# EAGLE design DCSolar_3Cur_1Volt (EAGLE 5.10)
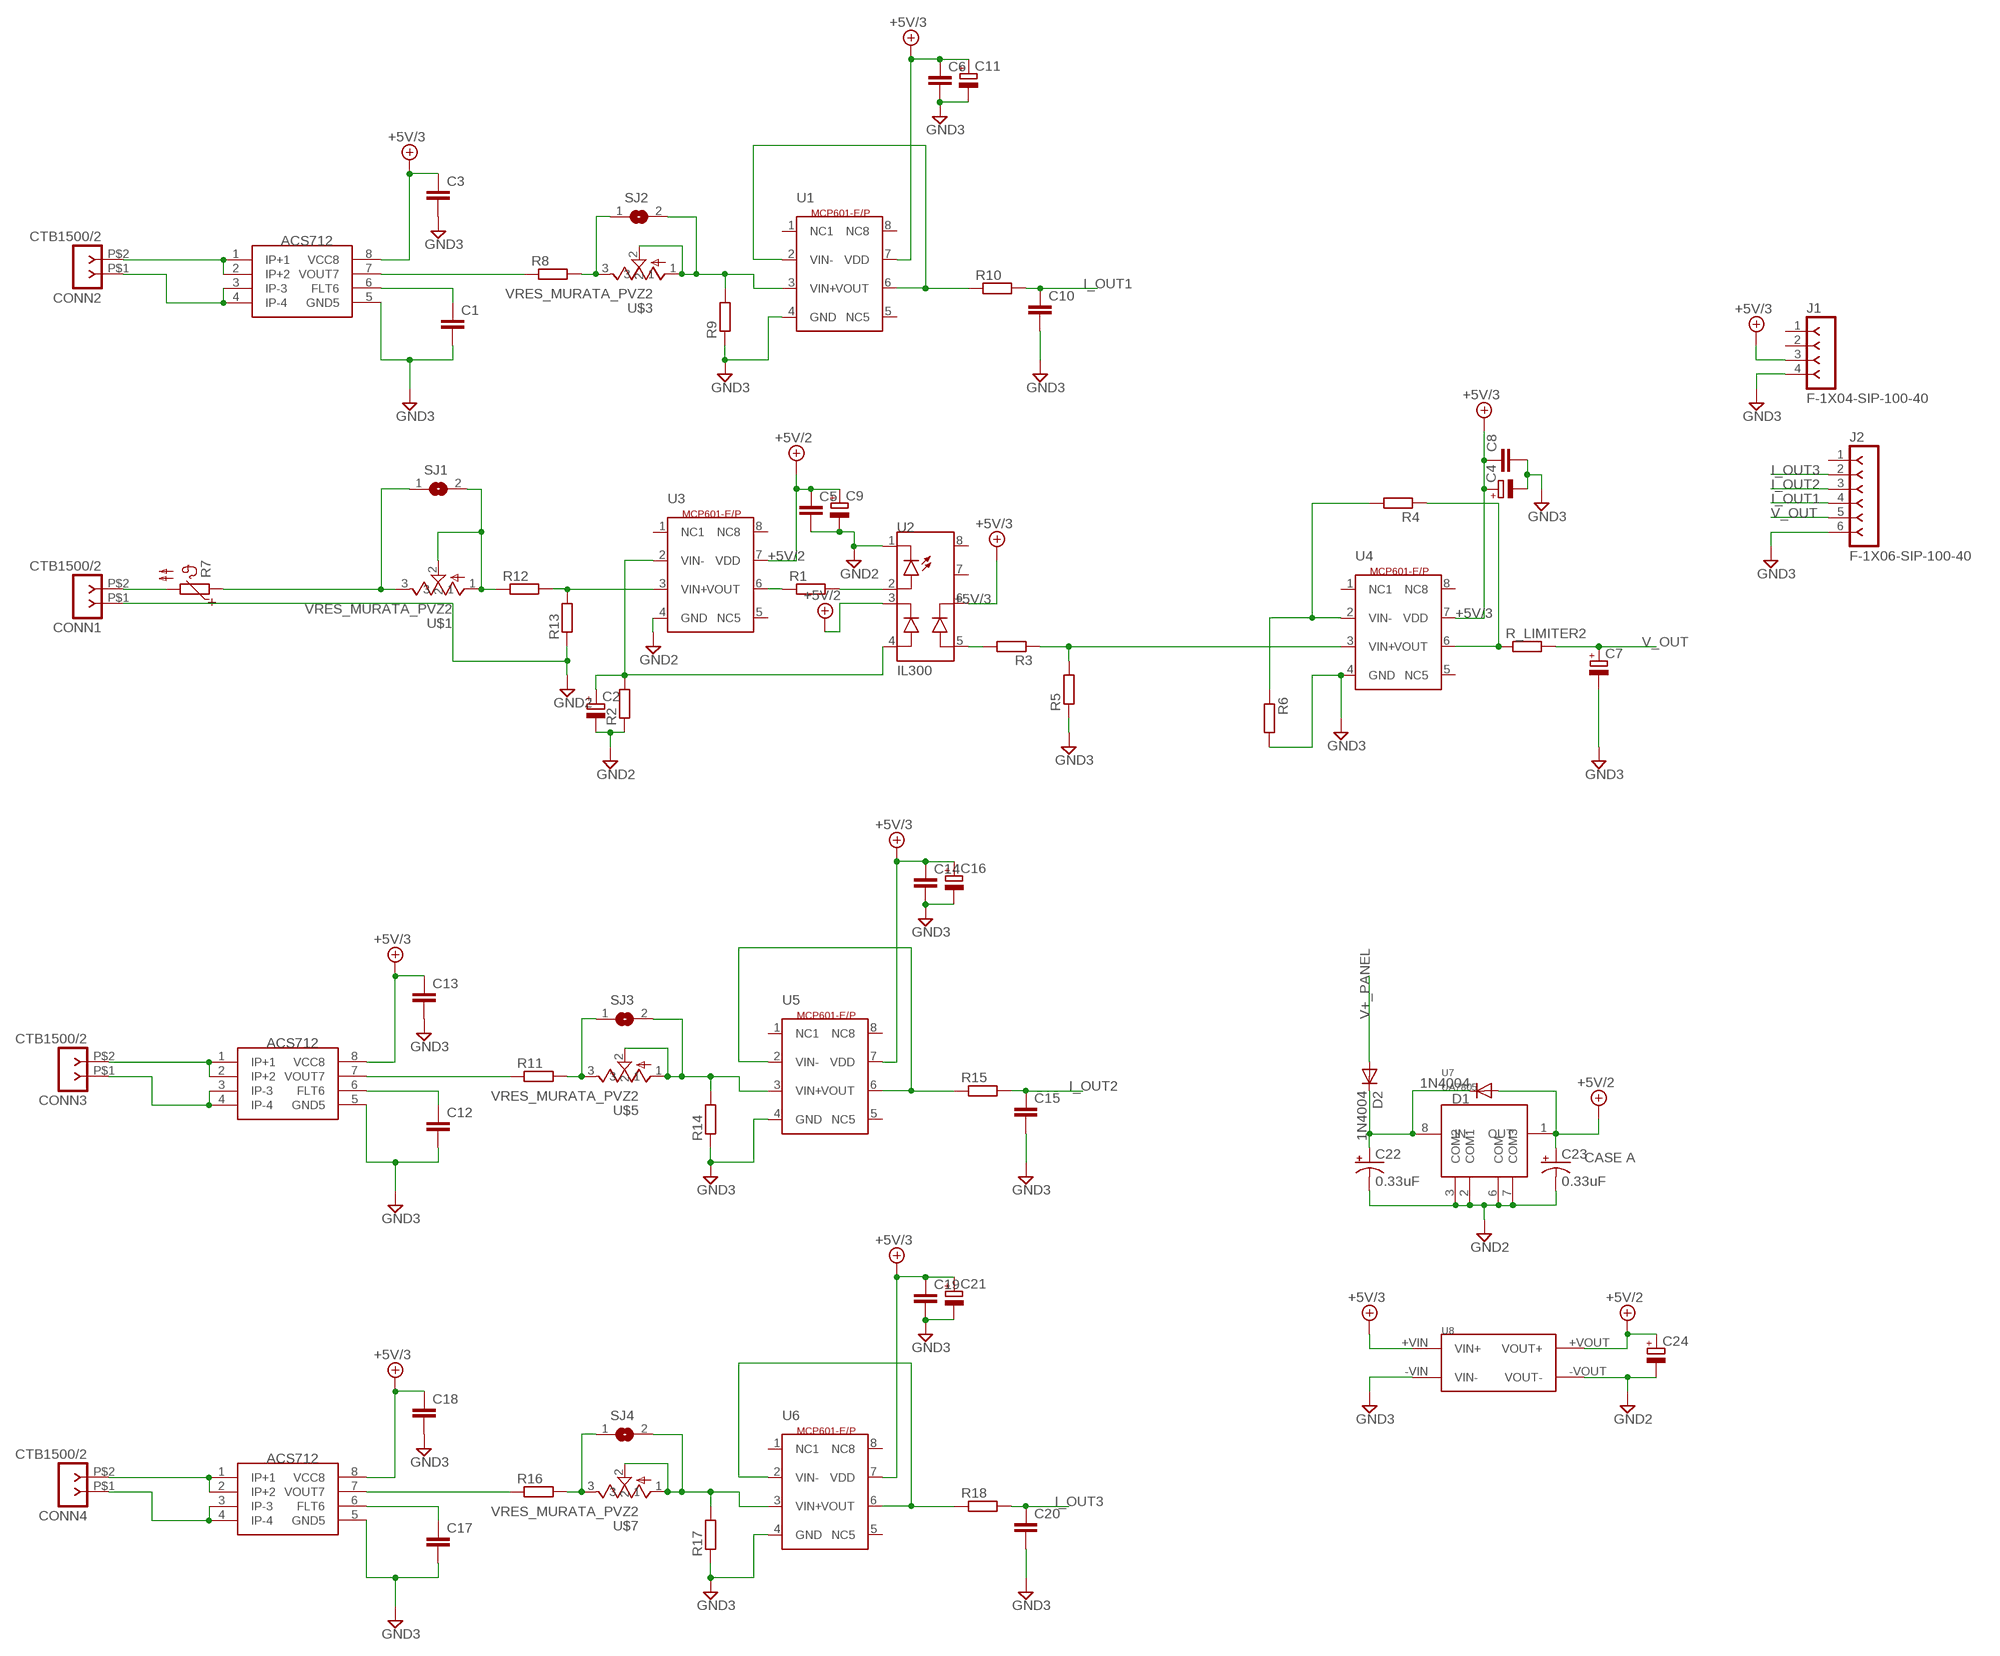
[diagram p0: schematic, sheet 1]

## Parts
C1  C-EU025-030X050  [C025-030X050]
C2  CPOL-EUE2.5-6  [E2,5-6]
C3  C-EUC0603  [C0603]
C4  CPOL-EUE2.5-6  [E2,5-6]
C5  C-EUC0603  [C0603]
C6  C-EUC0603  [C0603]
C7  CPOL-EUE2.5-6  [E2,5-6]
C8  C-EUC0603  [C0603]
C9  CPOL-EUE2.5-6  [E2,5-6]
C10  C-EU025-030X050  [C025-030X050]
C11  CPOL-EUE2.5-6  [E2,5-6]
C12  C-EU025-030X050  [C025-030X050]
C13  C-EUC0603  [C0603]
C14  C-EUC0603  [C0603]
C15  C-EU025-030X050  [C025-030X050]
C16  CPOL-EUE2.5-6  [E2,5-6]
C17  C-EU025-030X050  [C025-030X050]
C18  C-EUC0603  [C0603]
C19  C-EUC0603  [C0603]
C20  C-EU025-030X050  [C025-030X050]
C21  CPOL-EUE2.5-6  [E2,5-6]
C22  0.33uF  CPOL-USA/3216-18W  [A/3216-18W]
C23  0.33uF  CPOL-USA/3216-18W  [A/3216-18W]
C24  CPOL-EUE2.5-6  [E2,5-6]
CONN1  CTB1500/2  [CTB1500-2]
CONN2  CTB1500/2  [CTB1500-2]
CONN3  CTB1500/2  [CTB1500-2]
CONN4  CTB1500/2  [CTB1500-2]
D1  1N4004  [DO41-10]
D2  1N4004  [DO41-10]
J1  F-1X04-SIP-100-40  [SIP-100-04-40]
J2  F-1X06-SIP-100-40  [SIP-100-06-40]
R1  R-EU_0207/10  [0207/10]
R2  R-EU_0207/10  [0207/10]
R3  R-EU_0207/10  [0207/10]
R4  R-EU_0207/10  [0207/10]
R5  R-EU_0207/10  [0207/10]
R6  R-EU_0207/10  [0207/10]
R7  PTC660A  [P660A]
R8  R-EU_0207/10  [0207/10]
R9  R-EU_0207/10  [0207/10]
R10  R-EU_0207/10  [0207/10]
R11  R-EU_0207/10  [0207/10]
R12  R-EU_0207/10  [0207/10]
R13  R-EU_0207/10  [0207/10]
R14  R-EU_0207/10  [0207/10]
R15  R-EU_0207/10  [0207/10]
R16  R-EU_0207/10  [0207/10]
R17  R-EU_0207/10  [0207/10]
R18  R-EU_0207/10  [0207/10]
R_LIMITER2  R-EU_0207/10  [0207/10]
SJ1  SJ  [SJ]
SJ2  SJ  [SJ]
SJ3  SJ  [SJ]
SJ4  SJ  [SJ]
U1  MCP601  [SO8]
U2  IL300  [SO8]
U3  MCP601  [SO8]
U4  MCP601  [SO8]
U5  MCP601  [SO8]
U6  MCP601  [SO8]
U7  UA7805  [R_PDSO_G8]
U8  XP_IE_1W_DCDC  [SF_IE_SIP]
U$1  VRES_MURATA_PVZ2  [MURATA_PVZ2A]
U$2  ACS712  [SO8]
U$3  VRES_MURATA_PVZ2  [MURATA_PVZ2A]
U$4  ACS712  [SO8]
U$5  VRES_MURATA_PVZ2  [MURATA_PVZ2A]
U$6  ACS712  [SO8]
U$7  VRES_MURATA_PVZ2  [MURATA_PVZ2A]

## Nets
+5V/2: C5.1 C9.+ C23.+ C24.+ D1.A U2.3(C_FB) U3.7(VDD) U7.1(OUT) U8.+VOUT(VOUT+)
+5V/3: C3.1 C4.+ C6.1 C8.1 C11.+ C13.1 C14.1 C16.+ C18.1 C19.1 C21.+ J1.3 U1.7(VDD) U2.6(C_OUT) U4.7(VDD) U5.7(VDD) U6.7(VDD) U8.+VIN(VIN+) U$2.8(VCC8) U$4.8(VCC8) U$6.8(VCC8)
GND2: C2.- C5.2 C9.- C22.- C23.- C24.- CONN1.P$1 R2.1 R13.1 U2.1(C_LED) U3.4(GND) U7.2(COM1) U7.3(COM2) U7.6(COM) U7.7(COM3) U8.-VOUT(VOUT-)
GND3: C1.2 C3.2 C4.- C6.2 C7.- C8.2 C10.2 C11.- C12.2 C13.2 C14.2 C15.2 C16.- C17.2 C18.2 C19.2 C20.2 C21.- J1.4 J2.6 R5.1 R6.2 R9.1 R14.1 R17.1 U1.4(GND) U4.4(GND) U5.4(GND) U6.4(GND) U8.-VIN(VIN-) U$2.5(GND5) U$4.5(GND5) U$6.5(GND5)
I_OUT1: C10.1 J2.4 R10.2
I_OUT2: C15.1 J2.3 R15.2
I_OUT3: C20.1 J2.2 R18.2
N$1: R1.2 U2.2(A_LED)
N$2: R1.1 U3.6(VOUT)
N$3: C2.+ R2.2 U2.4(A_FB) U3.2(VIN-)
N$4: R8.2 SJ2.1 U$3.3
N$5: CONN1.P$2 R7.2
N$6: R4.1 R_LIMITER2.1 U4.6(VOUT)
N$7: R3.2 U2.5(A_OUT)
N$8: R4.2 R6.1 U4.2(VIN-)
N$9: CONN2.P$2 U$2.1(IP+1) U$2.2(IP+2)
N$10: CONN2.P$1 U$2.3(IP-3) U$2.4(IP-4)
N$11: R10.1 U1.2(VIN-) U1.6(VOUT)
N$12: R12.2 R13.2 U3.3(VIN+)
N$13: C1.1 U$2.6(FLT6)
N$14: CONN3.P$2 U$4.1(IP+1) U$4.2(IP+2)
N$15: CONN3.P$1 U$4.3(IP-3) U$4.4(IP-4)
N$16: R8.1 U$2.7(VOUT7)
N$17: R9.2 SJ2.2 U1.3(VIN+) U$3.1 U$3.2
N$18: R12.1 SJ1.2 U$1.1 U$1.2
N$19: CONN4.P$2 U$6.1(IP+1) U$6.2(IP+2)
N$20: C12.1 U$4.6(FLT6)
N$21: R11.1 U$4.7(VOUT7)
N$22: R14.2 SJ3.2 U5.3(VIN+) U$5.1 U$5.2
N$23: R11.2 SJ3.1 U$5.3
N$24: R15.1 U5.2(VIN-) U5.6(VOUT)
N$25: CONN4.P$1 U$6.3(IP-3) U$6.4(IP-4)
N$26: C17.1 U$6.6(FLT6)
N$27: R16.1 U$6.7(VOUT7)
N$28: R17.2 SJ4.2 U6.3(VIN+) U$7.1 U$7.2
N$29: R16.2 SJ4.1 U$7.3
N$30: R18.1 U6.2(VIN-) U6.6(VOUT)
N$31: C22.+ D1.C D2.C U7.8(IN)
U4: R3.1 R5.2 U4.3(VIN+)
V+_PANEL: D2.A R7.1 SJ1.1 U$1.3
V_OUT: C7.+ J2.5 R_LIMITER2.2
Unconnected: J1.1 J1.2 J2.1 U1.1(NC1) U1.5(NC5) U1.8(NC8) U2.7(PIN7) U2.8(PIN8) U3.1(NC1) U3.5(NC5) U3.8(NC8) U4.1(NC1) U4.5(NC5) U4.8(NC8) U5.1(NC1) U5.5(NC5) U5.8(NC8) U6.1(NC1) U6.5(NC5) U6.8(NC8)

## Notes on the sheet
- CASE A

## Library data of the parts
C1 C3 C5 C6 C8 C10 C12-C15 C17-C20 = resistor:C-EU: CAPACITOR, European symbol
C2 C4 C7 C9 C11 C16 C21 C24 = resistor:CPOL-EU: POLARIZED CAPACITOR, European symbol
C22 C23 = resistor:CPOL-US: POLARIZED CAPACITOR, American symbol
CONN1-CONN4 = eko-parts:CTB1500/2
D1 D2 = diode:1N4004: DIODE general purpose rectifier, 1 A
J1 = con-headers-jp:F-1X04-: FEMALE HEADER
J2 = con-headers-jp:F-1X06-: FEMALE HEADER
R1-R6 R8-R18 R_LIMITER2 = resistor:R-EU_: RESISTOR, European symbol
R7 = ptc-ntc:PTC660A: PHILIPS PTC; OC_FARNELL: unknown; OC_NEWARK: unknown
SJ1-SJ4 = jumper:SJ: SMD solder JUMPER
U1 U3-U6 = eko-parts:MCP601
U2 = eko-parts:IL300
U7 = eko-parts:UA7805
U8 = eko-parts:XP_IE_1W_DCDC
U$1 U$3 U$5 U$7 = eko-parts:VRES_MURATA_PVZ2: http://www.farnell.com/datasheets/477473.pdf http://onecall.farnell.com/jsp/search/browse.jsp?N=411+202462+110264549+732+502&Ns=P_PRICE_ONECALL_UK|0&locale=en_GB&appliedparametrics=true&getResults=true&suppressRedirect=true&originalQueryURL=/jsp/search/browse.jsp%3FN%3D411%2B202462%26No%3D0%26getResults%3Dtrue%26appliedparametrics%3Dtrue%26locale%3Den_GB%26divisionLocale%3Den_GB%26catalogId%3D%26prevNValues%3D411%2B202462
U$2 U$4 U$6 = eko-parts:ACS712

## Board
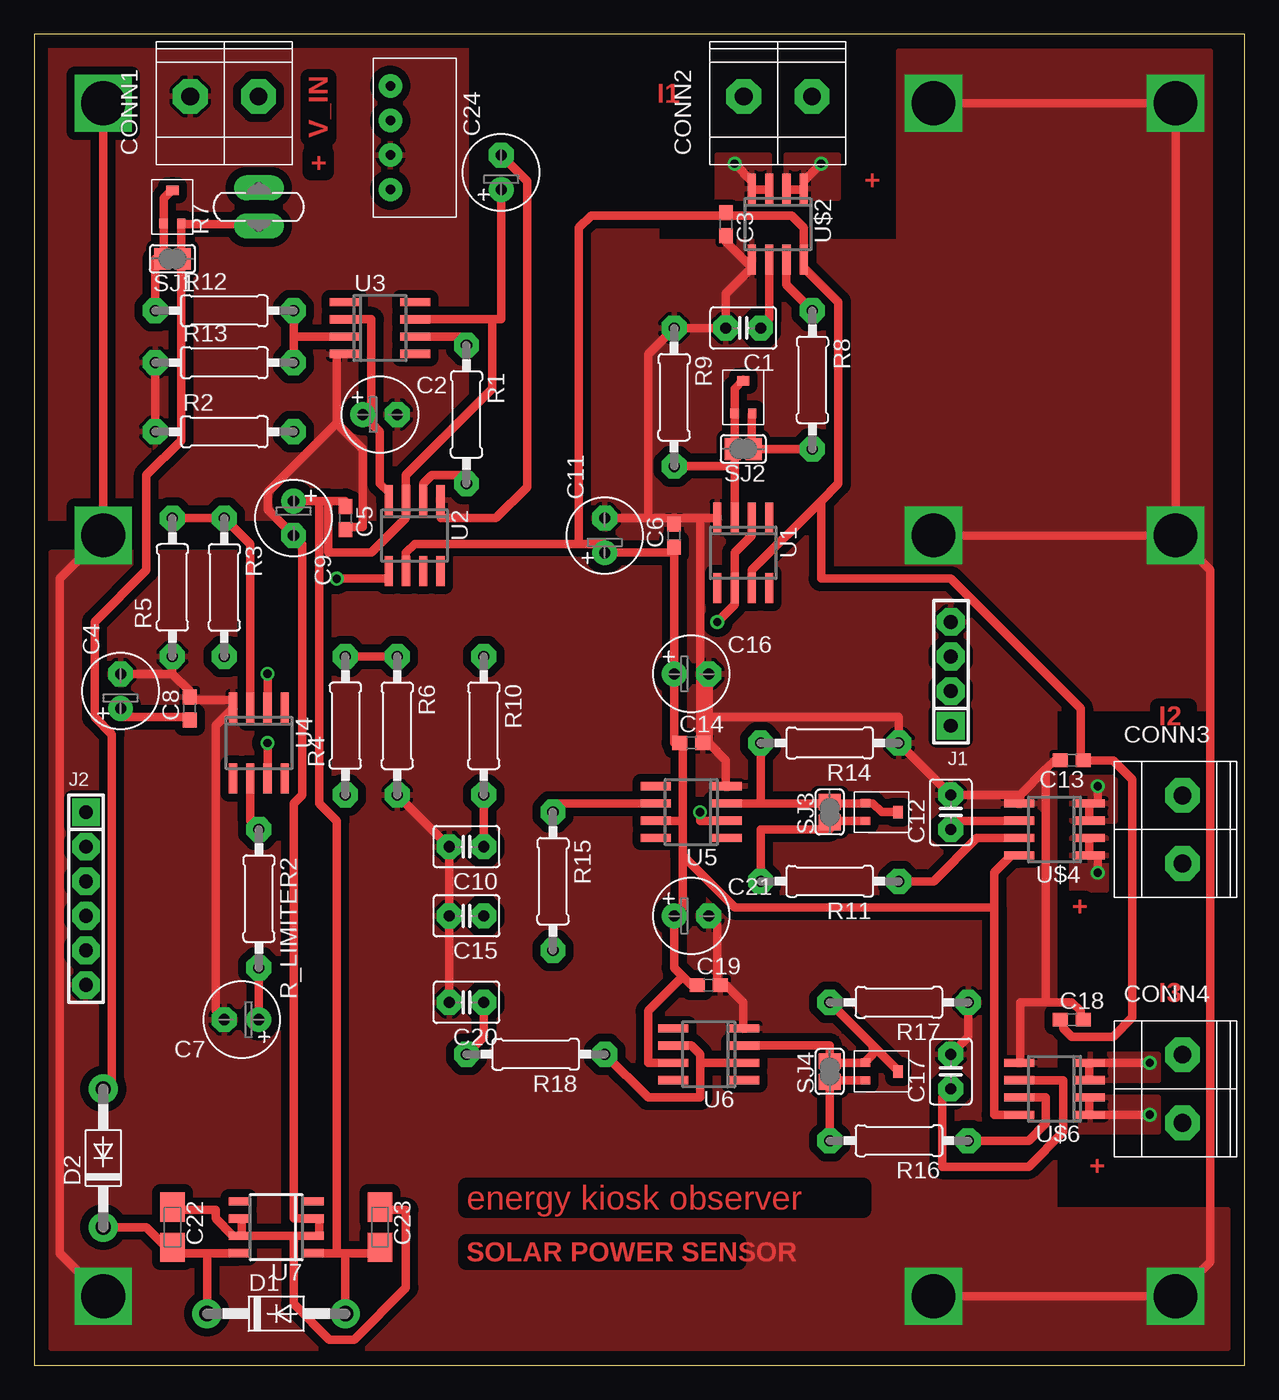
[diagram p1: board, top side]
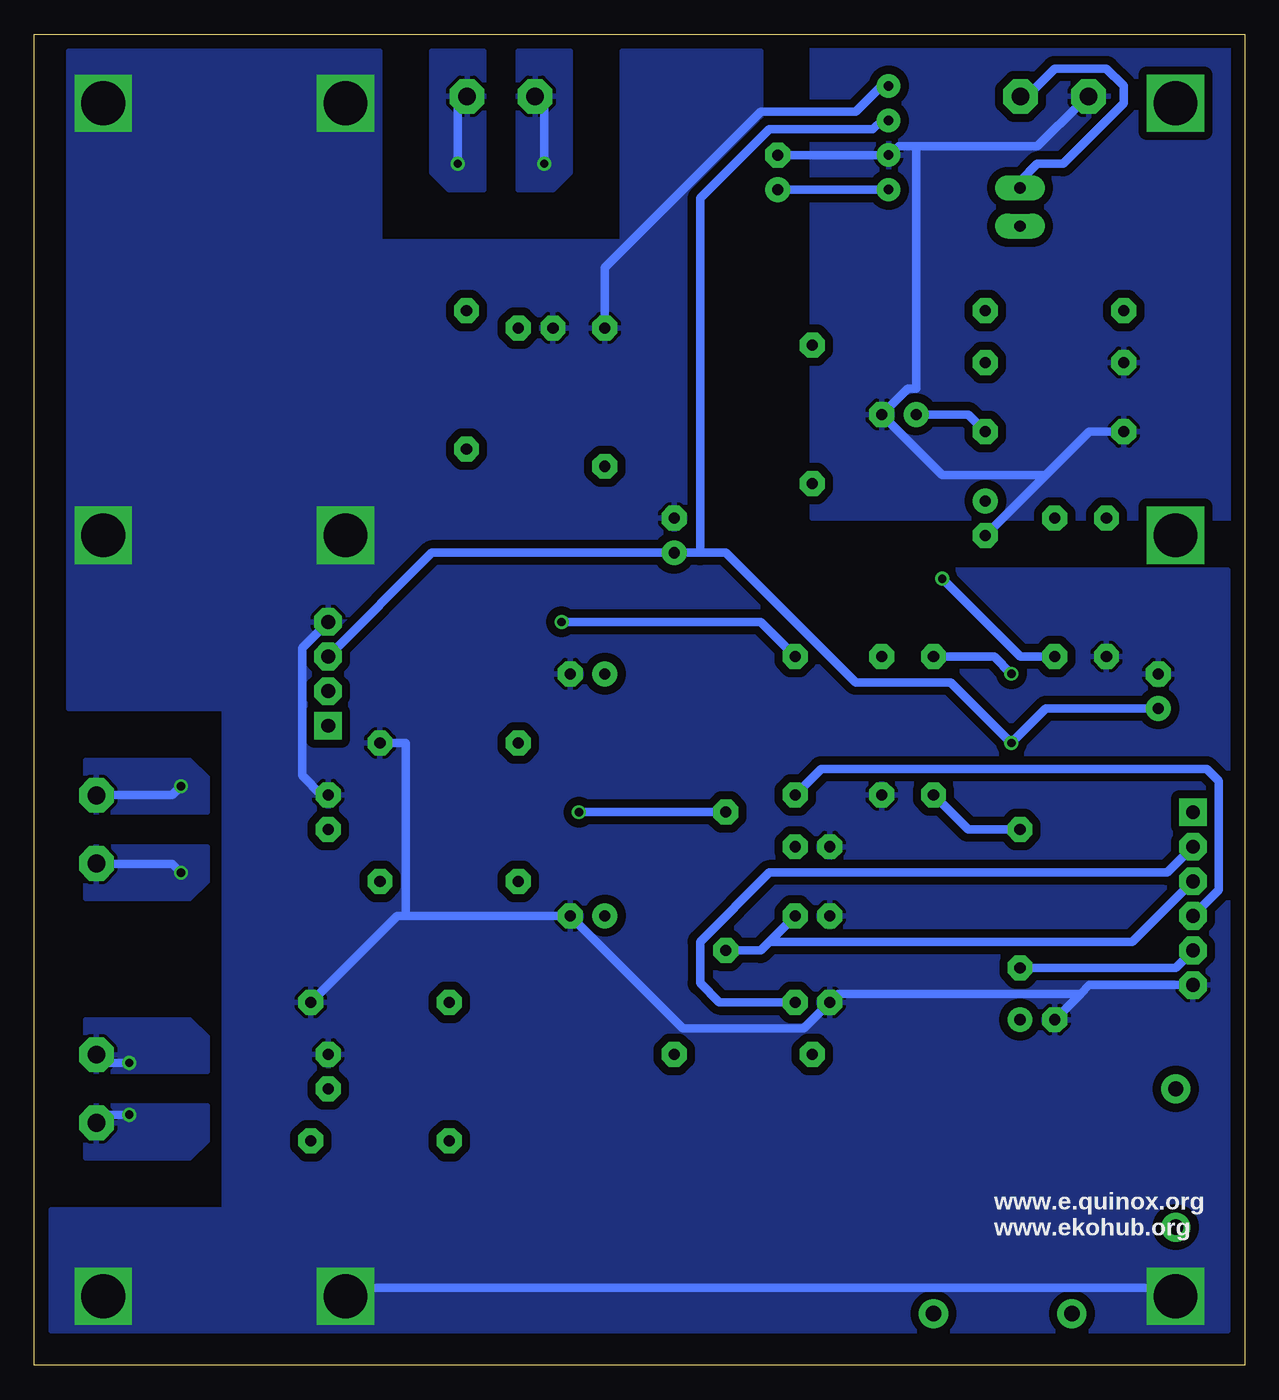
[diagram p2: board, bottom side, seen from below]

Size 88.9 x 97.79 mm. Coordinates in mm from the lower left corner, seen from the top.
Outline: 0,0 88.9,0 88.9,97.79 0,97.79 0,0
Copper layers (1*16): Top 0.035mm / dielectric 1.5mm / Bottom 0.035mm
Design rules "default *": minimum track width 15mil, minimum drill 24mil, track to track 16mil, track to pad 16mil, pad to pad 16mil, via to via 16mil, smd to smd 8mil, copper to edge 40mil, drill to drill 8mil, minimum pad ring 20mil, minimum via ring 8mil, stop-mask expansion 4mil, vias tented up to drill 0mil, thermal gap 10mil

### Footprints (pad centres in the part's own frame; a part is rotated, then mirrored left to right if it is on the bottom)
C025-030X050 = drill 0.813 octagon: 1 -1.27,0; 2 1.27,0
E2,5-6 = drill 0.813 pad 1.6 round: + -1.27,0 | drill 0.813 pad 1.6 octagon: - 1.27,0
C0603 = smd 1.1 x 1: 1 -0.85,0; 2 0.85,0
A/3216-18W = smd 2.15 x 1.8: + 1.475,0; - -1.475,0
CTB1500-2 = drill 1.3 pad 2.54 octagon: P$1 -2.5,0.5; P$2 2.5,0.5
DO41-10 = drill 1.118 round: A 5.08,0; C -5.08,0
SIP-100-04-40 = drill 1.016 pad 1.778 square: 1 -3.81,0 | drill 1.016 pad 1.778 octagon: 2 -1.27,0; 3 1.27,0; 4 3.81,0
SIP-100-06-40 = drill 1.016 pad 1.778 square: 1 -6.35,0 | drill 1.016 pad 1.778 octagon: 2 -3.81,0; 3 -1.27,0; 4 1.27,0; 5 3.81,0; 6 6.35,0
0207/10 = drill 0.813 octagon: 1 -5.08,0; 2 5.08,0
P660A = drill 0.813 long: 1 -1.397,0; 2 1.397,0
SJ = smd 1.168 x 1.6: 1 -0.762,0; 2 0.762,0
SO8 = smd 0.6 x 2.2: 1 -1.905,-2.6; 2 -0.635,-2.6; 3 0.635,-2.6; 4 1.905,-2.6; 5 1.905,2.6; 6 0.635,2.6; 7 -0.635,2.6; 8 -1.905,2.6
R_PDSO_G8 = smd 0.6 x 1.5: 1 -1.905,-2.75; 2 -0.635,-2.75; 3 0.635,-2.75; 4 1.905,-2.75; 5 1.905,2.75; 6 0.635,2.75; 7 -0.635,2.75; 8 -1.905,2.75
SF_IE_SIP = drill 0.7 round: +VIN -1.27,-1.778; +VOUT 3.81,-1.778; -VIN -3.81,-1.778; -VOUT 1.27,-1.778
MURATA_PVZ2A = smd 0.6 x 0.7: 1 -0.65,-1.2; 3 0.65,-1.2 | smd 0.9 x 0.7: 2 0,1.2

### Placement (x,y rotation side)
C1  52.07,76.2 180 top
C2  25.4,69.85 0 top
C3  50.8,83.82 270 top
C4  6.35,49.53 90 top
C5  22.86,62.23 270 top
C6  46.99,60.96 90 top
C7  15.24,25.4 180 top
C8  11.43,48.26 90 top
C9  19.05,62.23 270 top
C10  31.75,38.1 180 top
C11  41.91,60.96 90 top
C12  67.31,40.64 90 top
C13  76.2,44.45 180 top
C14  48.26,45.72 0 top
C15  31.75,33.02 180 top
C16  48.26,50.8 0 top
C17  67.31,21.59 90 top
C18  76.2,25.4 0 top
C19  49.53,27.94 0 top
C20  31.75,26.67 180 top
C21  48.26,33.02 0 top
C22  10.16,10.16 270 top
C23  25.4,10.16 270 top
C24  34.29,87.63 90 top
CONN1  13.97,92.71 0 top
CONN2  54.61,92.71 0 top
CONN3  83.82,39.37 270 top
CONN4  83.82,20.32 270 top
D1  17.78,3.81 0 top
D2  5.08,15.24 90 top
J1  67.31,50.8 90 top
J2  3.81,34.29 270 top
R1  31.75,69.85 270 top
R2  13.97,68.58 0 top
R3  13.97,57.15 270 top
R4  22.86,46.99 90 top
R5  10.16,57.15 90 top
R6  26.67,46.99 270 top
R7  16.51,85.09 90 top
R8  57.15,72.39 270 top
R9  46.99,71.12 270 top
R10  33.02,46.99 270 top
R11  58.42,35.56 180 top
R12  13.97,77.47 0 top
R13  13.97,73.66 0 top
R14  58.42,45.72 180 top
R15  38.1,35.56 270 top
R16  63.5,16.51 180 top
R17  63.5,26.67 180 top
R18  36.83,22.86 180 top
R_LIMITER2  16.51,34.29 270 top
SJ1  10.16,81.28 180 top
SJ2  52.07,67.31 180 top
SJ3  58.42,40.64 90 top
SJ4  58.42,21.59 90 top
U1  52.07,59.69 180 top
U2  27.94,60.96 180 top
U3  25.4,76.2 270 top
U4  16.51,45.72 180 top
U5  48.26,40.64 90 top
U6  49.53,22.86 90 top
U7  17.78,10.16 90 top
U8  27.94,90.17 270 top
U$1  10.16,85.09 0 top
U$2  54.61,83.82 180 top
U$3  52.07,71.12 0 top
U$4  74.93,39.37 90 top
U$5  62.23,40.64 270 top
U$6  74.93,20.32 90 top
U$7  62.23,21.59 270 top

### Tracks (layer width: path | path; a pad name or v marks a point on that pad's centre or on a via)
+5V/2
  Top 0.61: 33.66,76.83 34.29,76.83 C24.+ | 33.66,76.83 U3.7 | 22.86,8.26 25.4,8.26 C23.+ | 22.86,8.26 22.23,8.26 | 22.23,8.26 U7.1 | D1.A 22.86,8.26 | 20.95,63.5 C9.+ | 20.95,63.5 21.59,63.5 | 21.59,63.5 22.86,63.5 C5.1 | 21.59,63.5 21.59,59.69 24.77,59.69 27.3,62.23 U2.3 27.3,65.41 33.66,71.75 33.66,76.83 | 22.23,8.26 22.23,40.01 20.95,41.27 20.95,63.5
  Bottom 0.61: C24.+ U8.+VOUT
+5V/3  (via drill 0.61)
  Top 0.61: C18.1 75.56,25.4 75.56,24.77 76.2,24.13 79.22,24.13 80.64,25.55 80.64,43.03 79.22,44.45 C13.1 76.83,44.45 76.83,48.26 67.31,57.78 57.78,57.78 57.78,63.5 | 50.8,84.45 55.62,84.45 56.52,83.56 U$2.8 56.52,80.64 59.05,78.11 59.05,64.77 57.78,63.5 | 57.78,63.5 52.7,58.42 U1.7 | 70.48,33.66 70.48,36.2 71.75,37.47 U$4.8 | 70.48,33.66 70.48,18.41 U$6.8 | 47.62,28.57 46.99,29.21 C21.+ 47.62,33.66 47.62,37.47 | 47.62,28.57 48.26,27.94 C19.1 | 47.62,28.57 45.09,26.04 45.09,22.23 U6.7 | 47.62,40.01 47.62,45.72 C14.1 46.99,45.72 C16.+ 46.99,59.69 | 47.62,40.01 U5.7 | 47.62,40.01 47.62,37.47 | 70.48,33.66 51.44,33.66 47.62,37.47 | C4.+ 6.35,47.62 11.43,47.62 C8.1 | v17.14,45.72 U4.7 | 46.99,59.69 C11.+ 41.91,60.33 40.01,60.33 | 40.01,60.33 27.94,60.33 27.3,59.69 U2.6 | 46.99,59.69 C6.1 | 40.01,60.33 40.01,83.56 40.9,84.45 50.8,84.45 | 50.8,84.45 C3.1
  Bottom 0.61: C4.+ 14.61,48.26 v17.14,45.72 21.59,50.16 28.57,50.16 38.1,59.69 40.01,59.69 | 40.01,59.69 40.01,85.72 34.92,90.81 27.3,90.81 26.67,91.44 U8.+VIN | 40.01,59.69 C11.+ 59.69,59.69 J1.3
GND2
  Top 0.61: C24.- 36.2,87 36.2,64.52 33.91,62.23 29.84,62.23 U2.1 | 15.24,9.53 15.24,10.79 U7.6 | 15.24,9.53 19.05,9.53 | 15.24,9.53 U7.7 14.61,9.53 13.34,10.79 13.34,11.43 10.16,11.43 C22.- | 19.05,9.53 U7.2 20.95,9.53 20.95,10.79 U7.3 19.05,10.79 19.05,41.27 19.68,41.91 19.68,60.33 C9.- 17.14,62.87 17.14,64.14 22.23,69.22 | 19.05,9.53 19.05,4.52 21.67,1.91 23.5,1.91 27.3,5.71 27.3,11.43 25.4,11.43 C23.- | 22.23,69.22 24.13,67.31 24.13,61.59 22.86,61.59 C5.2 | 22.23,69.22 22.23,74.3 U3.4 | R2.1 R13.1
  Bottom 0.61: C24.- U8.-VOUT 26.04,88.9 25.4,89.53 24.13,89.53 | 24.13,89.53 15.24,89.53 12.06,92.71 CONN1.P$1 | 14.61,65.41 11.43,68.58 R2.1 | C9.- 14.61,65.41 | 14.61,65.41 22.23,65.41 C2.- 24.77,71.75 24.13,71.75 24.13,89.53
  pour Bottom (isolate 0.61): 0,97.79 31.75,97.79 31.75,62.23 0,62.23
  pour Top (isolate 0.61): 0,97.79 31.75,97.79 31.75,62.23 0,62.23
GND3  (via drill 3.2 pad 0.41)
  Top 0.61: C20.2 C15.2 C10.2 R6.2 | 10.16,50.8 11.43,49.53 C8.2 11.43,48.9 14.61,48.9 U4.4 14.61,48.26 13.34,46.99 13.34,26.04 C7.- | 10.16,50.8 R5.1 | 10.16,50.8 C4.- | 52.7,80.64 50.8,82.55 C3.2 | 52.7,80.64 50.8,78.74 C1.2 R9.1 45.09,74.3 45.09,62.23 | 52.7,80.64 U$2.5 | C17.2 68.58,24.13 R17.1 | U6.4 52.07,24.77 52.07,26.67 50.8,27.94 C19.2 50.16,27.94 50.16,32.38 C21.- | 48.9,62.23 50.16,62.23 U1.4 | 48.9,62.23 46.99,62.23 | 45.09,62.23 C11.- | 46.99,62.23 45.09,62.23 | 46.99,62.23 C6.2 | 49.53,45.72 50.8,44.45 50.8,42.55 U5.4 | 49.53,47.62 C16.- | 49.53,47.62 49.53,45.72 | 49.53,45.72 C14.2 48.9,45.72 48.9,62.23 | 74.3,26.67 72.39,26.67 72.39,22.23 U$6.5 | 74.3,26.67 76.2,26.67 76.83,26.04 76.83,25.4 C18.2 | 72.39,41.91 74.3,43.81 | 74.3,43.81 74.93,44.45 C13.2 | 72.39,41.91 72.39,41.27 U$4.5 | 72.39,41.91 C12.2 R14.1 63.5,47.62 49.53,47.62 | 74.3,43.81 74.3,26.67 | v5.08,5.08 1.91,8.26 1.91,57.78 v5.08,60.96 v5.08,92.71 | v66.04,92.71 v83.82,92.71 v83.82,60.96 | v66.04,5.08 v83.82,5.08 86.36,7.62 86.36,58.42 v83.82,60.96 | v83.82,60.96 v66.04,60.96
  Bottom 0.61: 12.06,27.3 11.43,27.94 J2.6 | 12.06,27.3 C7.- | 12.06,27.3 29.84,27.3 C20.2 32.38,24.77 41.27,24.77 C21.- 61.59,33.02 | R9.1 46.99,80.64 35.56,92.08 28.57,92.08 26.67,93.98 U8.-VIN | R17.1 62.23,33.02 61.59,33.02 | J1.4 69.22,52.7 69.22,43.33 67.8,41.91 C12.2 | 61.59,33.02 61.59,45.72 R14.1 | v5.08,5.08 5.71,5.71 65.41,5.71 v66.04,5.08
  pour Bottom (isolate 0.61): 87.63,11.43 74.93,11.43 74.93,48.26 86.36,48.26 86.36,96.52 63.5,96.52 63.5,95.25 63.5,82.55 45.72,82.55 45.72,96.52 35.56,96.52 35.56,58.42 1.27,58.42 1.27,2.54 87.63,2.54
  pour Top (isolate 0.61): 35.56,96.52 45.72,96.52 45.72,82.55 63.5,82.55 63.5,96.52 86.36,96.52 86.36,48.26 74.93,48.26 74.93,11.43 87.63,11.43 87.63,1.27 1.27,1.27 1.27,59.69 35.56,59.69
I_OUT1
  Top 0.61: R10.2 C10.1
  Bottom 0.61: J2.4 1.91,34.92 1.91,42.92 2.8,43.81 31.11,43.81 R10.2
I_OUT2
  Bottom 0.61: 34.92,31.11 35.56,30.48 R15.2 | 34.92,31.11 C15.1 | J2.3 8.26,31.11 34.92,31.11
I_OUT3
  Top 0.61: R18.2 33.02,24.13 C20.1
  Bottom 0.61: J2.2 5.71,36.2 34.92,36.2 40.01,31.11 40.01,28.09 38.59,26.67 C20.1
N$1
  Top 0.61: R1.2 31.75,65.41 29.21,65.41 28.57,64.77 U2.2
N$2
  Top 0.61: R1.1 31.75,75.56 U3.6
N$3
  Top 0.61: 24.77,69.22 25.4,68.58 25.4,64.77 26.04,64.14 U2.4 | 24.77,69.22 24.77,76.83 U3.2 | C2.+ 24.77,69.22
  Bottom 0.61: R2.2 20.32,69.85 C2.+
N$4
  Top 0.61: U$3.3 52.7,69.85 52.7,67.31 SJ2.1 R8.2
N$5
  Bottom 0.61: R7.2 16.51,87 15.24,88.27 13.34,88.27 8.89,92.71 8.89,93.98 10.16,95.25 13.97,95.25 15.88,93.34 CONN1.P$2
N$6
  Top 0.61: R_LIMITER2.1 15.88,40.01 U4.6
  Bottom 0.61: R4.1 20.32,39.37 R_LIMITER2.1
N$7  (via drill 0.61)
  Top 0.61: v22.23,57.78 26.04,57.78 U2.5
  Bottom 0.61: v22.23,57.78 16.51,52.07 R3.2
N$8  (via drill 0.61)
  Top 0.61: U4.2 v17.14,50.8 | R4.2 R6.1
  Bottom 0.61: v17.14,50.8 18.41,52.07 R4.2
N$9  (via drill 0.61)
  Top 0.61: U$2.2 55.24,86.36 56.52,86.36 U$2.1 56.52,87 v57.78,88.27
  Bottom 0.61: v57.78,88.27 57.78,92.71 57.15,92.71 CONN2.P$2
  pour Bottom: 55.88,96.52 55.88,86.36 58.42,86.36 59.69,87.63 59.69,96.52
  pour Top: 55.24,85.72 55.24,88.9 59.05,88.9 59.05,85.72
N$10  (via drill 0.61)
  Top 0.61: U$2.3 53.98,86.36 52.7,86.36 U$2.4 52.7,87 v51.44,88.27
  Bottom 0.61: v51.44,88.27 51.44,92.71 52.07,92.71 CONN2.P$1
  pour Bottom: 49.53,96.52 53.34,96.52 53.34,86.36 50.8,86.36 49.53,87.63
  pour Top: 53.98,88.9 53.98,85.72 50.16,85.72 50.16,88.9
N$11  (via drill 0.61)
  Top 0.61: U1.2 52.7,60.96 51.44,59.69 U1.6 51.44,55.88 v50.16,54.61
  Bottom 0.61: R10.1 35.56,54.61 v50.16,54.61
N$12
  Top 0.61: 19.05,75.56 R12.2 | 19.05,75.56 U3.3 | R13.2 19.05,75.56
N$13
  Top 0.61: C1.1 53.98,76.83 U$2.6
N$14  (via drill 0.61)
  Top 0.61: U$4.2 77.47,38.73 77.47,37.47 U$4.1 78.11,37.47 v78.11,36.2
  Bottom 0.61: v78.11,36.2 78.74,36.83 83.82,36.83 CONN3.P$2
  pour Bottom: 85.09,38.1 76.2,38.1 76.2,35.56 77.47,34.29 85.09,34.29
  pour Top: 78.74,38.73 76.2,38.73 76.2,34.92 78.74,34.92
N$15  (via drill 0.61)
  Top 0.61: U$4.3 77.47,40.01 77.47,41.27 U$4.4 78.11,41.27 v78.11,42.55
  Bottom 0.61: v78.11,42.55 78.74,41.91 83.82,41.91 CONN3.P$1
  pour Bottom: 85.09,40.64 76.2,40.64 76.2,43.18 77.47,44.45 85.09,44.45
  pour Top: 79.38,40.01 76.2,40.01 76.2,43.18 79.38,43.18
N$16
  Top 0.61: R8.1 55.24,79.38 U$2.7
N$17
  Top 0.61: 51.44,67.31 51.44,69.85 | 51.44,69.85 51.44,71.75 52.07,72.39 U$3.2 | 51.44,69.85 U$3.1 | 51.44,66.04 51.44,67.31 | U1.3 51.44,66.04 | 51.44,67.31 SJ2.2 | 51.44,66.04 R9.2
N$18
  Top 0.61: 9.53,83.82 9.53,81.28 SJ1.2 8.89,81.28 R12.1 | 9.53,83.82 9.53,85.72 10.16,86.36 U$1.2 | 9.53,83.82 U$1.1
N$19  (via drill 0.61)
  Top 0.61: U$6.2 77.47,19.68 77.47,18.41 U$6.1 v81.92,18.41
  Bottom 0.61: v81.92,18.41 83.82,18.41 CONN4.P$2
  pour Bottom: 85.09,19.05 76.2,19.05 76.2,16.51 77.47,15.24 85.09,15.24
  pour Top: 82.55,19.68 76.83,19.68 76.83,17.14 82.55,17.14
N$20
  Top 0.61: C12.1 67.31,40.01 U$4.6
N$21
  Top 0.61: R11.1 66.04,35.56 69.22,38.73 U$4.7
N$22
  Top 0.61: 58.42,41.27 60.96,41.27 | 60.96,41.27 61.59,41.27 62.23,40.64 U$5.2 63.5,40.64 | 60.96,41.27 U$5.1 | 53.34,41.27 R14.2 | U5.3 53.34,41.27 | 53.34,41.27 58.42,41.27 | 58.42,41.27 SJ3.2
N$23
  Top 0.61: U$5.3 60.96,40.01 58.42,40.01 SJ3.1 58.42,39.37 53.34,39.37 R11.2
N$24  (via drill 0.61)
  Top 0.61: R15.1 38.1,41.27 U5.6 | v48.9,40.64 48.9,40.01 U5.2
  Bottom 0.61: R15.1 v48.9,40.64
N$25  (via drill 0.61)
  Top 0.61: U$6.3 77.47,20.95 77.47,22.23 U$6.4 v81.92,22.23
  Bottom 0.61: v81.92,22.23 83.82,22.23 CONN4.P$1
  pour Bottom: 85.09,25.4 77.47,25.4 76.2,24.13 76.2,21.59 85.09,21.59
  pour Top: 81.92,20.95 76.83,20.95 76.83,22.86 82.55,22.86 82.55,20.95
N$26
  Top 0.61: C17.1 66.67,19.68 66.67,14.61 73.03,14.61 75.56,17.14 75.56,20.95 U$6.6
N$27
  Top 0.61: R16.1 73.03,16.51 74.3,17.78 74.3,19.68 U$6.7
N$28
  Top 0.61: 60.96,22.23 58.42,22.23 SJ4.2 58.42,23.5 U6.3 | 61.59,23.5 R17.2 | 61.59,23.5 63.5,21.59 U$7.2 | 60.96,22.23 61.59,22.86 61.59,23.5 | 60.96,22.23 U$7.1
N$29
  Top 0.61: U$7.3 60.96,20.95 58.42,20.95 SJ4.1 R16.2
N$30
  Top 0.61: 48.9,22.23 48.9,22.86 48.26,23.5 U6.6 | 48.9,22.23 U6.2 | R18.1 45.09,19.68 48.9,19.68 48.9,22.23
N$31
  Top 0.61: 12.7,8.26 10.16,8.26 | 12.7,8.26 U7.8 | D1.C 12.7,8.26 | D2.C 8.26,10.16 10.16,8.26 | 10.16,8.26 C22.+
U4
  Top 0.61: U4.3 15.88,60.33 R3.1 R5.2
V+_PANEL
  Top 0.61: 10.79,81.28 10.79,83.82 | 10.79,83.82 16.51,83.82 R7.1 | 10.79,83.82 U$1.3 | D2.A 5.71,20.95 5.71,46.35 4.45,47.62 4.45,54.61 8.26,58.42 8.26,65.41 10.79,67.94 10.79,81.28 | 10.79,81.28 SJ1.1
V_OUT
  Top 0.61: R_LIMITER2.2 C7.+
  Bottom 0.61: J2.5 5.08,29.21 R_LIMITER2.2

### Text on the board
Top: I1 | V_IN | + | + | I2 | + | I3 | + | energy kiosk observer | SOLAR POWER SENSOR
bPlace: www.e.quinox.org | www.ekohub.org